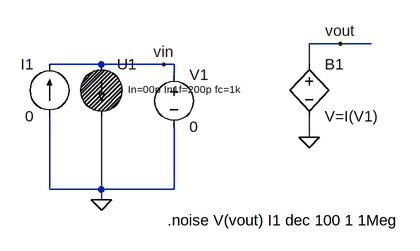
[diagram p0: schematic noisecurrentsrc_test.asc]
noisecurrentsrc_test.asc, the LTspice schematic file:
Version 4
SHEET 1 880 680
WIRE 688 96 640 96
WIRE 736 96 688 96
WIRE 320 128 240 128
WIRE 416 128 320 128
WIRE 432 128 416 128
WIRE 640 128 640 96
WIRE 432 144 432 128
WIRE 640 240 640 208
WIRE 240 320 240 208
WIRE 320 320 320 208
WIRE 320 320 240 320
WIRE 432 320 432 224
WIRE 432 320 320 320
WIRE 320 336 320 320
FLAG 320 336 0
FLAG 416 128 vin
FLAG 640 240 0
FLAG 688 96 vout
SYMBOL voltage 432 128 R0
SYMATTR InstName V1
SYMATTR Value 0
SYMBOL current 240 208 R180
WINDOW 0 24 80 Left 2
WINDOW 3 24 0 Left 2
SYMATTR InstName I1
SYMATTR Value 0
SYMBOL circuiTikz\\noisecurrent 320 128 R0
SYMATTR InstName U1
SYMATTR SpiceLine In=00p In1f=200p fc=1k
SYMBOL bv 640 112 R0
SYMATTR InstName B1
SYMATTR Value V=I(V1)
TEXT 422 368 Left 2 !.noise V(vout) I1 dec 100 1 1Meg

The netlist it stands for:
* noisecurrentsrc_test.asc
V1 vin 0 0
I1 0 vin 0
XU1 vin 0 noisecurrentsource In=00p In1f=200p fc=1k  ; pins + -
B1 vout 0 V=I(V1)
.noise V(vout) I1 dec 100 1 1Meg
.lib circuiTikz/noisecurrentsource.sub
.backanno
.end